# EAGLE schematic unit_module (EAGLE 7.2.0)
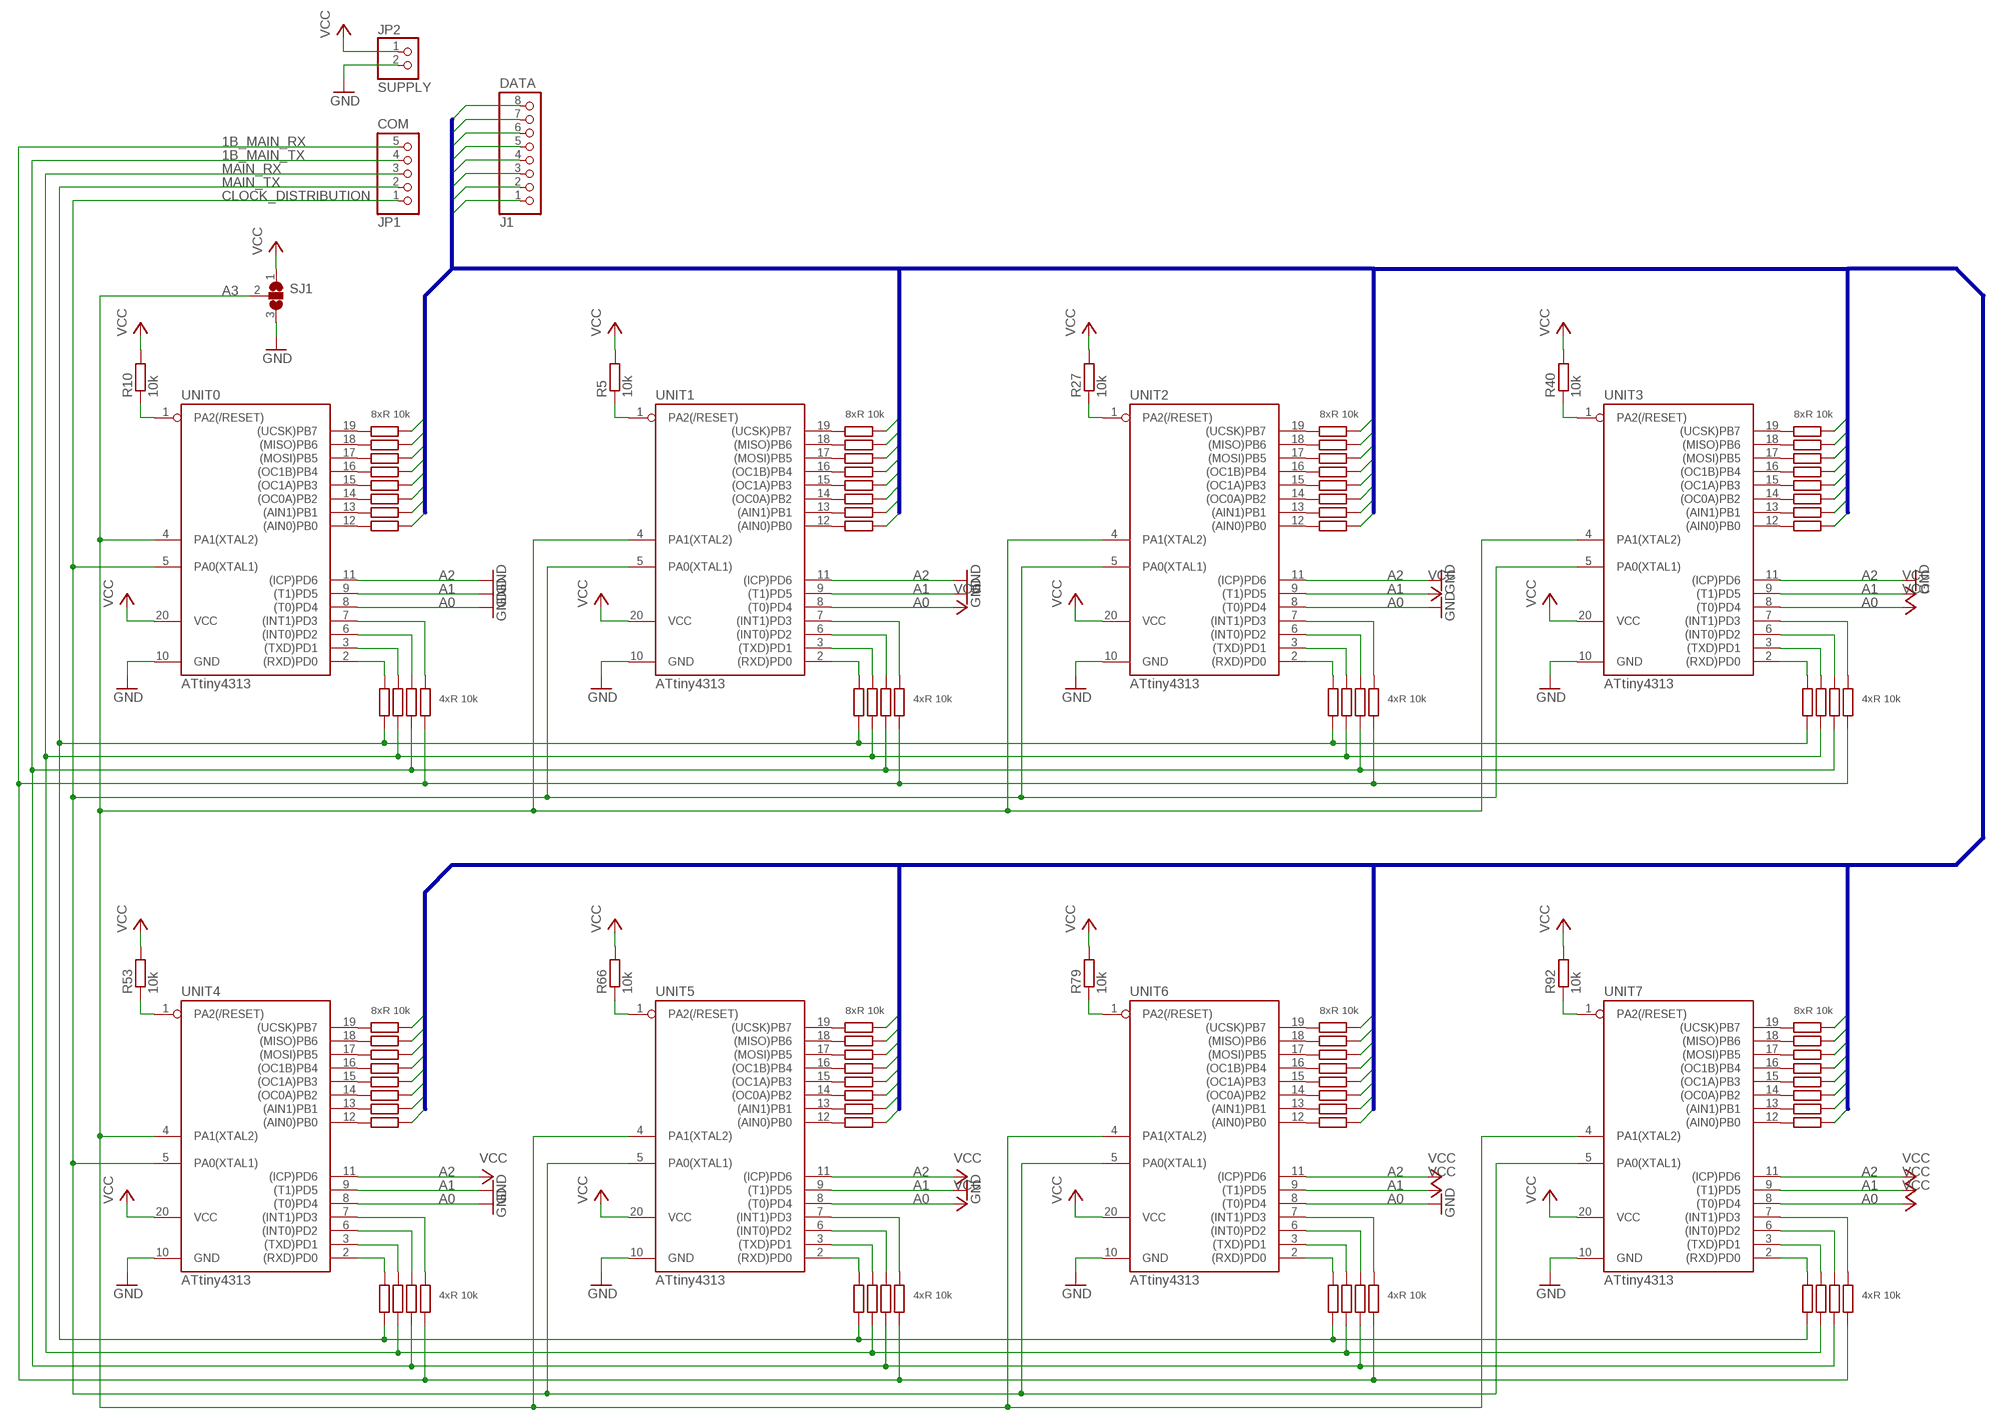
[diagram p0: schematic, sheet 1]

## Parts
J1  DATA  PINHD-1X8  [1X08]
JP1  COM  PINHD-1X5  [1X05]
JP2  SUPPLY  PINHD-1X2  [1X02]
R1  10k  R-EU_R0603  [R0603]
R2  10k  R-EU_R0603  [R0603]
R3  10k  R-EU_R0603  [R0603]
R4  10k  R-EU_R0603  [R0603]
R5  10k  R-EU_R0603  [R0603]
R6  10k  R-EU_R0603  [R0603]
R7  10k  R-EU_R0603  [R0603]
R8  10k  R-EU_R0603  [R0603]
R9  10k  R-EU_R0603  [R0603]
R10  10k  R-EU_R0603  [R0603]
R11  10k  R-EU_R0603  [R0603]
R12  10k  R-EU_R0603  [R0603]
R13  10k  R-EU_R0603  [R0603]
R14  10k  R-EU_R0603  [R0603]
R15  10k  R-EU_R0603  [R0603]
R16  10k  R-EU_R0603  [R0603]
R17  10k  R-EU_R0603  [R0603]
R18  10k  R-EU_R0603  [R0603]
R19  10k  R-EU_R0603  [R0603]
R20  10k  R-EU_R0603  [R0603]
R21  10k  R-EU_R0603  [R0603]
R22  10k  R-EU_R0603  [R0603]
R23  10k  R-EU_R0603  [R0603]
R24  10k  R-EU_R0603  [R0603]
R25  10k  R-EU_R0603  [R0603]
R26  10k  R-EU_R0603  [R0603]
R27  10k  R-EU_R0603  [R0603]
R28  10k  R-EU_R0603  [R0603]
R29  10k  R-EU_R0603  [R0603]
R30  10k  R-EU_R0603  [R0603]
R31  10k  R-EU_R0603  [R0603]
R32  10k  R-EU_R0603  [R0603]
R33  10k  R-EU_R0603  [R0603]
R34  10k  R-EU_R0603  [R0603]
R35  10k  R-EU_R0603  [R0603]
R36  10k  R-EU_R0603  [R0603]
R37  10k  R-EU_R0603  [R0603]
R38  10k  R-EU_R0603  [R0603]
R39  10k  R-EU_R0603  [R0603]
R40  10k  R-EU_R0603  [R0603]
R41  10k  R-EU_R0603  [R0603]
R42  10k  R-EU_R0603  [R0603]
R43  10k  R-EU_R0603  [R0603]
R44  10k  R-EU_R0603  [R0603]
R45  10k  R-EU_R0603  [R0603]
R46  10k  R-EU_R0603  [R0603]
R47  10k  R-EU_R0603  [R0603]
R48  10k  R-EU_R0603  [R0603]
R49  10k  R-EU_R0603  [R0603]
R50  10k  R-EU_R0603  [R0603]
R51  10k  R-EU_R0603  [R0603]
R52  10k  R-EU_R0603  [R0603]
R53  10k  R-EU_R0603  [R0603]
R54  10k  R-EU_R0603  [R0603]
R55  10k  R-EU_R0603  [R0603]
R56  10k  R-EU_R0603  [R0603]
R57  10k  R-EU_R0603  [R0603]
R58  10k  R-EU_R0603  [R0603]
R59  10k  R-EU_R0603  [R0603]
R60  10k  R-EU_R0603  [R0603]
R61  10k  R-EU_R0603  [R0603]
R62  10k  R-EU_R0603  [R0603]
R63  10k  R-EU_R0603  [R0603]
R64  10k  R-EU_R0603  [R0603]
R65  10k  R-EU_R0603  [R0603]
R66  10k  R-EU_R0603  [R0603]
R67  10k  R-EU_R0603  [R0603]
R68  10k  R-EU_R0603  [R0603]
R69  10k  R-EU_R0603  [R0603]
R70  10k  R-EU_R0603  [R0603]
R71  10k  R-EU_R0603  [R0603]
R72  10k  R-EU_R0603  [R0603]
R73  10k  R-EU_R0603  [R0603]
R74  10k  R-EU_R0603  [R0603]
R75  10k  R-EU_R0603  [R0603]
R76  10k  R-EU_R0603  [R0603]
R77  10k  R-EU_R0603  [R0603]
R78  10k  R-EU_R0603  [R0603]
R79  10k  R-EU_R0603  [R0603]
R80  10k  R-EU_R0603  [R0603]
R81  10k  R-EU_R0603  [R0603]
R82  10k  R-EU_R0603  [R0603]
R83  10k  R-EU_R0603  [R0603]
R84  10k  R-EU_R0603  [R0603]
R85  10k  R-EU_R0603  [R0603]
R86  10k  R-EU_R0603  [R0603]
R87  10k  R-EU_R0603  [R0603]
R88  10k  R-EU_R0603  [R0603]
R89  10k  R-EU_R0603  [R0603]
R90  10k  R-EU_R0603  [R0603]
R91  10k  R-EU_R0603  [R0603]
R92  10k  R-EU_R0603  [R0603]
R93  10k  R-EU_R0603  [R0603]
R94  10k  R-EU_R0603  [R0603]
R95  10k  R-EU_R0603  [R0603]
R96  10k  R-EU_R0603  [R0603]
R97  10k  R-EU_R0603  [R0603]
R98  10k  R-EU_R0603  [R0603]
R99  10k  R-EU_R0603  [R0603]
R100  10k  R-EU_R0603  [R0603]
R101  10k  R-EU_R0603  [R0603]
R102  10k  R-EU_R0603  [R0603]
R103  10k  R-EU_R0603  [R0603]
R104  10k  R-EU_R0603  [R0603]
SJ1  SJ2W  [SJ_2]
UNIT0  ATtiny4313  TINY2313-*P*  [DIL20]
UNIT1  ATtiny4313  TINY2313-*P*  [DIL20]
UNIT2  ATtiny4313  TINY2313-*P*  [DIL20]
UNIT3  ATtiny4313  TINY2313-*P*  [DIL20]
UNIT4  ATtiny4313  TINY2313-*P*  [DIL20]
UNIT5  ATtiny4313  TINY2313-*P*  [DIL20]
UNIT6  ATtiny4313  TINY2313-*P*  [DIL20]
UNIT7  ATtiny4313  TINY2313-*P*  [DIL20]

## Nets
1B_MAIN_RX: JP1.5 R4.2 R26.2 R39.2 R52.2 R65.2 R78.2 R91.2 R104.2
1B_MAIN_TX: JP1.4 R3.2 R25.2 R38.2 R51.2 R64.2 R77.2 R90.2 R103.2
A3: SJ1.2 UNIT0.4(PA1(XTAL2)) UNIT1.4(PA1(XTAL2)) UNIT2.4(PA1(XTAL2)) UNIT3.4(PA1(XTAL2)) UNIT4.4(PA1(XTAL2)) UNIT5.4(PA1(XTAL2)) UNIT6.4(PA1(XTAL2)) UNIT7.4(PA1(XTAL2))
CLOCK_DISTRIBUTION: JP1.1 UNIT0.5(PA0(XTAL1)) UNIT1.5(PA0(XTAL1)) UNIT2.5(PA0(XTAL1)) UNIT3.5(PA0(XTAL1)) UNIT4.5(PA0(XTAL1)) UNIT5.5(PA0(XTAL1)) UNIT6.5(PA0(XTAL1)) UNIT7.5(PA0(XTAL1))
DATA0: J1.1 R19.1 R22.1 R35.1 R48.1 R61.1 R74.1 R87.1 R100.1
DATA1: J1.2 R18.1 R21.1 R34.1 R47.1 R60.1 R73.1 R86.1 R99.1
DATA2: J1.3 R17.1 R20.1 R33.1 R46.1 R59.1 R72.1 R85.1 R98.1
DATA3: J1.4 R11.1 R16.1 R32.1 R45.1 R58.1 R71.1 R84.1 R97.1
DATA4: J1.5 R9.1 R15.1 R31.1 R44.1 R57.1 R70.1 R83.1 R96.1
DATA5: J1.6 R8.1 R14.1 R30.1 R43.1 R56.1 R69.1 R82.1 R95.1
DATA6: J1.7 R7.1 R13.1 R29.1 R42.1 R55.1 R68.1 R81.1 R94.1
DATA7: J1.8 R6.1 R12.1 R28.1 R41.1 R54.1 R67.1 R80.1 R93.1
GND: JP2.2 SJ1.3 UNIT0.8((T0)PD4) UNIT0.9((T1)PD5) UNIT0.10(GND) UNIT0.11((ICP)PD6) UNIT1.9((T1)PD5) UNIT1.10(GND) UNIT1.11((ICP)PD6) UNIT2.8((T0)PD4) UNIT2.10(GND) UNIT2.11((ICP)PD6) UNIT3.10(GND) UNIT3.11((ICP)PD6) UNIT4.8((T0)PD4) UNIT4.9((T1)PD5) UNIT4.10(GND) UNIT5.9((T1)PD5) UNIT5.10(GND) UNIT6.8((T0)PD4) UNIT6.10(GND) UNIT7.10(GND)
MAIN_RX: JP1.3 R2.2 R24.2 R37.2 R50.2 R63.2 R76.2 R89.2 R102.2
MAIN_TX: JP1.2 R1.2 R23.2 R36.2 R49.2 R62.2 R75.2 R88.2 R101.2
N$1: R1.1 UNIT0.2((RXD)PD0)
N$2: R3.1 UNIT0.6((INT0)PD2)
N$3: R2.1 UNIT0.3((TXD)PD1)
N$4: R4.1 UNIT0.7((INT1)PD3)
N$5: R5.1 UNIT1.1(PA2(/RESET))
N$6: R6.2 UNIT1.19((UCSK)PB7)
N$7: R7.2 UNIT1.18((MISO)PB6)
N$8: R8.2 UNIT1.17((MOSI)PB5)
N$9: R9.2 UNIT1.16((OC1B)PB4)
N$10: R11.2 UNIT1.15((OC1A)PB3)
N$11: R20.2 UNIT1.14((OC0A)PB2)
N$12: R21.2 UNIT1.13((AIN1)PB1)
N$13: R22.2 UNIT1.12((AIN0)PB0)
N$14: R23.1 UNIT1.2((RXD)PD0)
N$15: R10.1 UNIT0.1(PA2(/RESET))
N$16: R25.1 UNIT1.6((INT0)PD2)
N$17: R24.1 UNIT1.3((TXD)PD1)
N$18: R26.1 UNIT1.7((INT1)PD3)
N$19: R12.2 UNIT0.19((UCSK)PB7)
N$20: R13.2 UNIT0.18((MISO)PB6)
N$21: R14.2 UNIT0.17((MOSI)PB5)
N$22: R15.2 UNIT0.16((OC1B)PB4)
N$23: R16.2 UNIT0.15((OC1A)PB3)
N$24: R17.2 UNIT0.14((OC0A)PB2)
N$25: R18.2 UNIT0.13((AIN1)PB1)
N$26: R19.2 UNIT0.12((AIN0)PB0)
N$27: R27.1 UNIT2.1(PA2(/RESET))
N$28: R28.2 UNIT2.19((UCSK)PB7)
N$29: R29.2 UNIT2.18((MISO)PB6)
N$30: R30.2 UNIT2.17((MOSI)PB5)
N$31: R31.2 UNIT2.16((OC1B)PB4)
N$32: R32.2 UNIT2.15((OC1A)PB3)
N$33: R33.2 UNIT2.14((OC0A)PB2)
N$34: R34.2 UNIT2.13((AIN1)PB1)
N$35: R35.2 UNIT2.12((AIN0)PB0)
N$36: R36.1 UNIT2.2((RXD)PD0)
N$37: R38.1 UNIT2.6((INT0)PD2)
N$38: R37.1 UNIT2.3((TXD)PD1)
N$39: R39.1 UNIT2.7((INT1)PD3)
N$40: R40.1 UNIT3.1(PA2(/RESET))
N$41: R41.2 UNIT3.19((UCSK)PB7)
N$42: R42.2 UNIT3.18((MISO)PB6)
N$43: R43.2 UNIT3.17((MOSI)PB5)
N$44: R44.2 UNIT3.16((OC1B)PB4)
N$45: R45.2 UNIT3.15((OC1A)PB3)
N$46: R46.2 UNIT3.14((OC0A)PB2)
N$47: R47.2 UNIT3.13((AIN1)PB1)
N$48: R48.2 UNIT3.12((AIN0)PB0)
N$49: R49.1 UNIT3.2((RXD)PD0)
N$50: R51.1 UNIT3.6((INT0)PD2)
N$51: R50.1 UNIT3.3((TXD)PD1)
N$52: R52.1 UNIT3.7((INT1)PD3)
N$53: R53.1 UNIT4.1(PA2(/RESET))
N$54: R54.2 UNIT4.19((UCSK)PB7)
N$55: R55.2 UNIT4.18((MISO)PB6)
N$56: R56.2 UNIT4.17((MOSI)PB5)
N$57: R57.2 UNIT4.16((OC1B)PB4)
N$58: R58.2 UNIT4.15((OC1A)PB3)
N$59: R59.2 UNIT4.14((OC0A)PB2)
N$60: R60.2 UNIT4.13((AIN1)PB1)
N$61: R61.2 UNIT4.12((AIN0)PB0)
N$62: R62.1 UNIT4.2((RXD)PD0)
N$63: R64.1 UNIT4.6((INT0)PD2)
N$64: R63.1 UNIT4.3((TXD)PD1)
N$65: R65.1 UNIT4.7((INT1)PD3)
N$66: R66.1 UNIT5.1(PA2(/RESET))
N$67: R67.2 UNIT5.19((UCSK)PB7)
N$68: R68.2 UNIT5.18((MISO)PB6)
N$69: R69.2 UNIT5.17((MOSI)PB5)
N$70: R70.2 UNIT5.16((OC1B)PB4)
N$71: R71.2 UNIT5.15((OC1A)PB3)
N$72: R72.2 UNIT5.14((OC0A)PB2)
N$73: R73.2 UNIT5.13((AIN1)PB1)
N$74: R74.2 UNIT5.12((AIN0)PB0)
N$75: R75.1 UNIT5.2((RXD)PD0)
N$76: R77.1 UNIT5.6((INT0)PD2)
N$77: R76.1 UNIT5.3((TXD)PD1)
N$78: R78.1 UNIT5.7((INT1)PD3)
N$79: R79.1 UNIT6.1(PA2(/RESET))
N$80: R80.2 UNIT6.19((UCSK)PB7)
N$81: R81.2 UNIT6.18((MISO)PB6)
N$82: R82.2 UNIT6.17((MOSI)PB5)
N$83: R83.2 UNIT6.16((OC1B)PB4)
N$84: R84.2 UNIT6.15((OC1A)PB3)
N$85: R85.2 UNIT6.14((OC0A)PB2)
N$86: R86.2 UNIT6.13((AIN1)PB1)
N$87: R87.2 UNIT6.12((AIN0)PB0)
N$88: R88.1 UNIT6.2((RXD)PD0)
N$89: R90.1 UNIT6.6((INT0)PD2)
N$90: R89.1 UNIT6.3((TXD)PD1)
N$91: R91.1 UNIT6.7((INT1)PD3)
N$92: R92.1 UNIT7.1(PA2(/RESET))
N$93: R93.2 UNIT7.19((UCSK)PB7)
N$94: R94.2 UNIT7.18((MISO)PB6)
N$95: R95.2 UNIT7.17((MOSI)PB5)
N$96: R96.2 UNIT7.16((OC1B)PB4)
N$97: R97.2 UNIT7.15((OC1A)PB3)
N$98: R98.2 UNIT7.14((OC0A)PB2)
N$99: R99.2 UNIT7.13((AIN1)PB1)
N$100: R100.2 UNIT7.12((AIN0)PB0)
N$101: R101.1 UNIT7.2((RXD)PD0)
N$102: R103.1 UNIT7.6((INT0)PD2)
N$103: R102.1 UNIT7.3((TXD)PD1)
N$104: R104.1 UNIT7.7((INT1)PD3)
VCC: JP2.1 R5.2 R10.2 R27.2 R40.2 R53.2 R66.2 R79.2 R92.2 SJ1.1 UNIT0.20(VCC) UNIT1.8((T0)PD4) UNIT1.20(VCC) UNIT2.9((T1)PD5) UNIT2.20(VCC) UNIT3.8((T0)PD4) UNIT3.9((T1)PD5) UNIT3.20(VCC) UNIT4.11((ICP)PD6) UNIT4.20(VCC) UNIT5.8((T0)PD4) UNIT5.11((ICP)PD6) UNIT5.20(VCC) UNIT6.9((T1)PD5) UNIT6.11((ICP)PD6) UNIT6.20(VCC) UNIT7.8((T0)PD4) UNIT7.9((T1)PD5) UNIT7.11((ICP)PD6) UNIT7.20(VCC)

## Buses
DATA[0..7]

## Notes on the sheet
- 8xR 10k | 8xR 10k | 8xR 10k | 8xR 10k
- A2 | A2 | A2 | A2
- A1 | A1 | A1 | A1
- A0 | A0 | A0 | A0
- 4xR 10k | 4xR 10k | 4xR 10k | 4xR 10k
- 8xR 10k | 8xR 10k | 8xR 10k | 8xR 10k
- A2 | A2 | A2 | A2
- A1 | A1 | A1 | A1
- A0 | A0 | A0 | A0
- 4xR 10k | 4xR 10k | 4xR 10k | 4xR 10k

## Library data of the parts
J1 = pinhead:PINHD-1X8: PIN HEADER
JP1 = pinhead:PINHD-1X5: PIN HEADER
JP2 = pinhead:PINHD-1X2: PIN HEADER
R1-R104 = rcl:R-EU_: RESISTOR, European symbol
SJ1 = jumper:SJ2W: SMD solder JUMPER
UNIT0 UNIT1-UNIT7 = avr-7:TINY2313*: Atmel Tiny2313 2K Flash, 128 bytes EEPROM, 128 bytes RAM